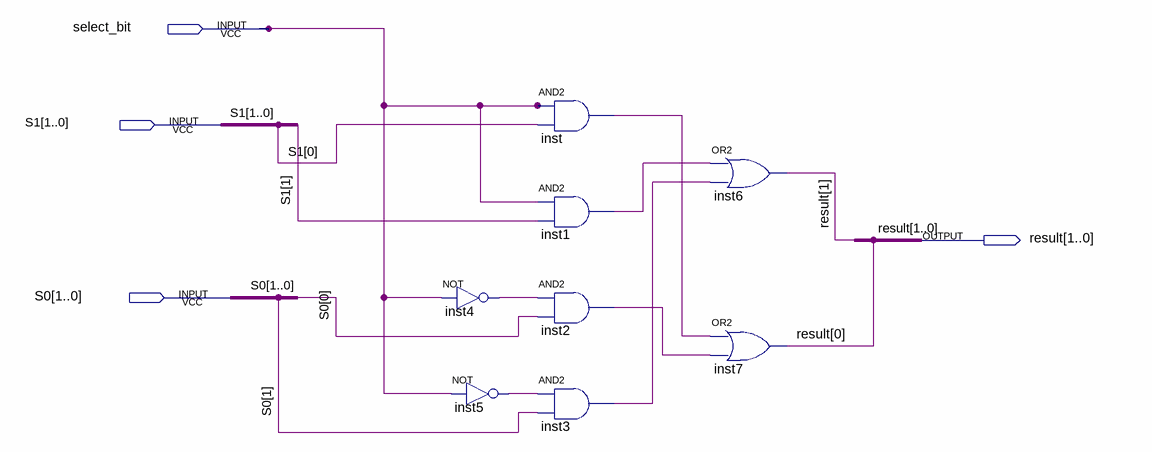
[diagram p0: schematic sheet]
// Quartus schematic MUX.bdf as structural Verilog: 8 symbols, 4 pins
module MUX (
  input  select_bit,
  input  [1:0] S1,
  input  [1:0] S0,
  output [1:0] result
);

  wire inst1_out, inst2_out, inst3_out, inst4_out, inst5_out, inst_out;

  not inst4 (inst4_out, select_bit);
  not inst5 (inst5_out, select_bit);
  and inst (inst_out, select_bit, S1[0]);
  and inst1 (inst1_out, select_bit, S1[1]);
  and inst2 (inst2_out, inst4_out, S0[0]);
  and inst3 (inst3_out, inst5_out, S0[1]);
  or inst6 (result[1], inst1_out, inst3_out);
  or inst7 (result[0], inst_out, inst2_out);
endmodule
